# Altium schematic sheet Matrix_Row.SchDoc
size A4; Author: Jan Rutkowski; CompanyName: AGH; SheetNumber: 2; SheetTotal: 4
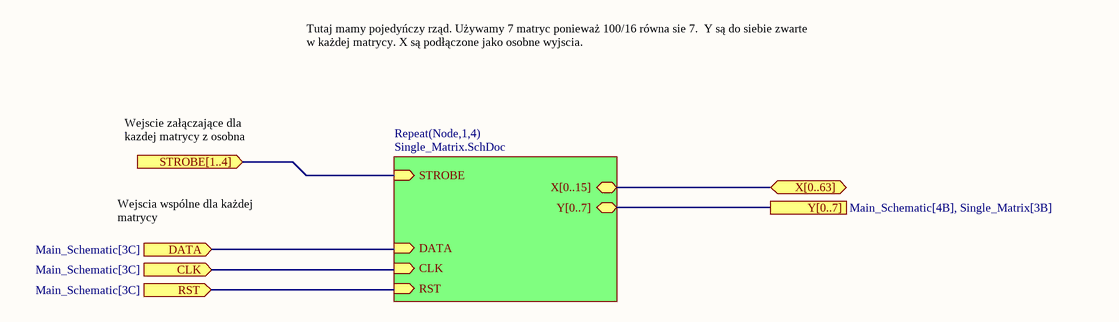
[diagram p0: Matrix_Row.SchDoc]

## Sub-sheets
Repeat(Node,1,4) = Single_Matrix.SchDoc: STROBE (in), DATA (in), CLK (in), RST (in), X[0..15] (bidir), Y[0..7] (bidir)

## Ports
CLK (in, see Main_Schematic[3C]), DATA (in, see Main_Schematic[3C]), RST (in, see Main_Schematic[3C]), STROBE[1..4] (in), X[0..63] (bidir), Y[0..7] (in, see Main_Schematic[4B], Single_Matrix[3B])

## Buses and harness runs
bus port X[0..63] = sheet Repeat(Node,1,4)/X[0..15]
bus port Y[0..7] = sheet Repeat(Node,1,4)/Y[0..7]

## Notes on the sheet
- Tutaj mamy pojedyńczy rząd. Używamy 7 matryc ponieważ 100/16 równa sie 7.  Y są do siebie zwarte w każdej matrycy. X są podłączone jako osobne wyjscia.
- Wejscie załączające dla kazdej matrycy z osobna
- Wejscia wspólne dla każdej matrycy
- Text
- Company Confidential / Not for distribution
- Project name:
- Document Name:
- Free Documents
- Sheet1.SchDoc
- Designer Name:
- Jan Rutkowski
- Date/Time:
- 10.03.26
- Revison:
- 1